# Altium schematic sheet 5.Battery.SchDoc
size A4; SheetNumber: 6; SheetTotal: 13
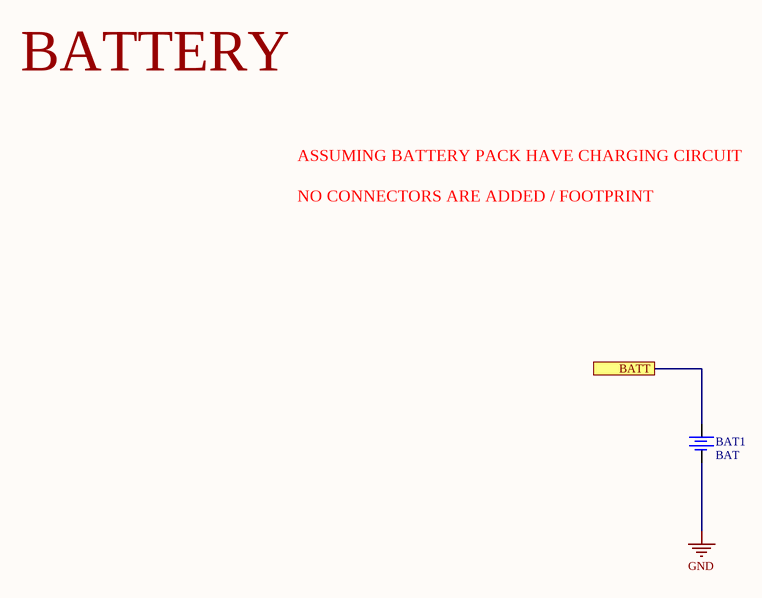
[diagram p0: 5.Battery.SchDoc]

## Parts
BAT1  BAT  [2P5mm_PITCH_COM]

## Ports
BATT

## Nets
GND: BAT1.1
BATT: BAT1.2 ; port BATT

## Notes on the sheet
- BATTERY
- ASSUMING BATTERY PACK HAVE CHARGING CIRCUIT
- NO CONNECTORS ARE ADDED / FOOTPRINT